# Altium schematic sheet TempSensor.SchDoc
size A4
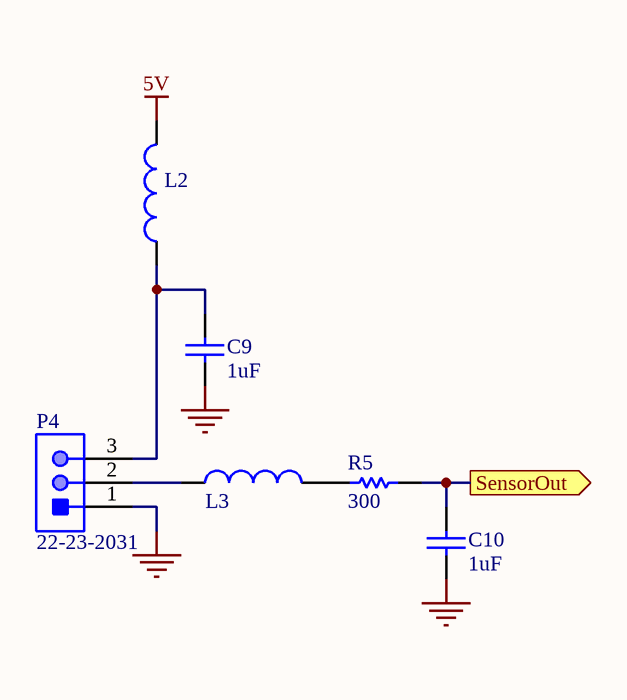
[diagram p0: TempSensor.SchDoc]

## Parts
C9  1uF  [CAPC0805(2012)145_N]
C10  1uF  [CAPC0805(2012)145_N]
L2  FBMJ2125HM210NT  [INDC2013X105X50LL20T30]  (value not drawn)
L3  FBMJ2125HM210NT  [INDC2013X105X50LL20T30]  (value not drawn)
P4  22-23-2031  [MOLX-22-23-2031_V]
R5  300  [RESC0805(2012)_M]

## Ports
SensorOut (out)

## Nets
5V: L2.2
GND: C9.2 C10.1 P4.1
SensorOut: C10.2 R5.2 ; port SensorOut
NetC9_1: C9.1 L2.1 P4.3
NetL3_1: L3.1 P4.2
NetL3_2: L3.2 R5.1

## Library data of the parts
C9 C10 = CMP-1036-04431-1: Case-Metric: 2012; Value: 100nF; Rated Voltage: 100 V; Tolerance: Â±20%; Case-EIA: 0805; Technology: SMT; Max Thickness: 1.45 mm
L2 L3 = CMP-1660-00003-1: Chip Inductor, 21 Ohm, +/- 30%, 6 A, -40 to 125 degC, 0805 (2012 Metric), RoHS, Tape and Reel; Core Material: Ferrite; Current Rating: 6 A; Resistance: 4 mohm; Case\Package: 0805; Impedance: 21 Ohm; Min Operating Temperature: -40 degC; Width: 1.25 mm; PackageDescription: 2-Pin Surface Mount Device, Body 2 x 1.25 mm; Mounting Technology: Surface Mount; Package Quantity: 1; DatasheetVersion: 08/2016; Tolerance: 30%; Mount: Surface Mount; Max Operating Temperature: 125 degC; Height: 0.85 mm; ComponentLink1URL: http://www.t-yuden.com/; Case Code (Metric): 2012; ComponentLink1Description: Manufacturer URL; ComponentLink2URL: http://ds.yuden.co.jp/TYCOMPAS/ut/detail.do?productNo=FBMJ2125HM210NT&fileName=FBMJ2125HM210NT_SS&mode=specSheetDownload; Case Code (Imperial): 0805; Packaging: Tape and Reel; ComponentLink2Description: Datasheet; PackageReference: 0805; RoHSCompliant: true; Max Current Rating: 6 A; Length: 2 mm; REACH SVHC: Unknown
P4 = CMP-2000-05242-1: Male Header, Pitch 2.54 mm, 1 x 3 Position, Height 8.18 mm, Tail Length 3.56 mm, RoHS, Bulk; Current Rating: 4A; Brand: Molex; Pitch: 2.54mm; Voltage Rating: 250V; Mounting Angle: Vertical; Type: Locking; Factory Pack Quantity: 16000; Tradename: KK; Housing Material: Nylon; Contact Material: Brass; Manufacturer URL: http://www.molex.com/; Termination Style: ThroughHole; Mounting Style: ThroughHole; Number of Positions: 3Position; Contact Gender: Pin(Male); Packaging: Bulk; Series: 6373; Datasheet Version: Sep-01; Contact Plating: Tin; Product: Headers; Datasheet URL: https://datasheet.ciiva.com/19472/232274-19472863.pdf; RoHS: Details; Product Category: Headers&WireHousings; Manufacturer: Molex; Number of Rows: 1Row
R5 = CMP-1013-00449-1: 300R 0.125W 1% 0805 (2012 Metric)  SMD; Case-Metric: 2012; Value: 300.00 Ohm; Case-EIA: 0805; Technology: SMT; Tolerance: 1 %; Power: 0.125 W